# EAGLE design TCXOBreakout (EAGLE 7.2.0)
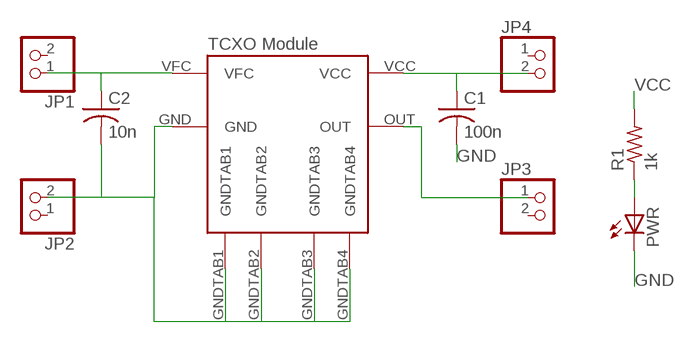
[diagram p0: schematic, sheet 1]

## Parts
C1  100n  C-USC0603  [C0603]
C2  10n  C-USC0603  [C0603]
JP1  PINHD-1X2  [1X02]
JP2  PINHD-1X2  [1X02]
JP3  PINHD-1X2  [1X02]
JP4  PINHD-1X2  [1X02]
PWR  LEDCHIPLED_0805  [CHIPLED_0805]
R1  1k  R-US_R0603  [R0603]
U$1  TCXO2  [TCXO2]

## Nets
GND: C1.2 C2.2 JP2.2 PWR.C U$1.GND U$1.GNDTAB1 U$1.GNDTAB2 U$1.GNDTAB3 U$1.GNDTAB4
N$1: PWR.A R1.1
N$2: C2.1 JP1.1 U$1.VFC
N$4: JP3.1 U$1.OUT
VCC: C1.1 JP4.2 R1.2 U$1.VCC
Unconnected: JP1.2 JP2.1 JP3.2 JP4.1

## Notes on the sheet
- TCXO Module

## Library data of the parts
C1 C2 = adafruit:C-US: CAPACITOR, American symbol
JP1-JP4 = pinhead:PINHD-1X2: PIN HEADER
PWR = adafruit:LED: LED OSRAM: - CHIPLED LG R971, LG N971, LY N971, LG Q971, LY Q971, LO R971, LY R971 LH N974, LH R974 LS Q976, LO Q976, LY Q976 LO Q996 - Hyper CHIPLED LW Q18S LB Q993, LB Q99A, LB R99A - SideLED LS A670, LO A670, LY A670, LG A670, LP A670 LB A673, LV A673, LT A673, LW A673 LH A674 LY A675 LS A676, LA A676, LO A676, LY A676, LW A676 LS A679, LY A679, LG A679 - Hyper Micro SIDELED® LS Y876, LA Y876, LO Y876, LY Y876 LT Y87S - SmartLED LW L88C, LW L88S LB L89C, LB L89S, LG L890 LS L89K, LO L89K, LY L89K LS L896, LA L896, LO L896, LY L896 - TOPLED LS T670, LO T670, LY T670, LG T670, LP T670 LSG T670, LSP T670, LSY T670, LOP T670, LYG T670 LG T671, LOG T671, LSG T671 LB T673, LV T673, LT T673, LW T673 LH T674 LS T676, LA T676, LO T676, LY T676, LB T676, LH T676, LSB T676, LW T676 LB T67C, LV T67C, LT T67C, LS T67K, LO T67K, LY T67K, LW E67C LS E67B, LA E67B, LO E67B, LY E67B, LB E67C, LV E67C, LT E67C LW T67C LS T679, LY T679, LG T679 LS T770, LO T770, LY T770, LG T770, LP T770 LB T773, LV T773, LT T773, LW T773 LH T774 LS E675, LA E675, LY E675, LS T675 LS T776, LA T776, LO T776, LY T776, LB T776 LHGB T686 LT T68C, LB T68C - Hyper Mini TOPLED® LB M676 - Mini TOPLED Santana® LG M470 LS M47K, LO M47K, LY M47K Source: http://www.osram.convergy.de/
R1 = adafruit:R-US_: RESISTOR, American symbol
U$1 = _CustomParts:TCXO2

## Board
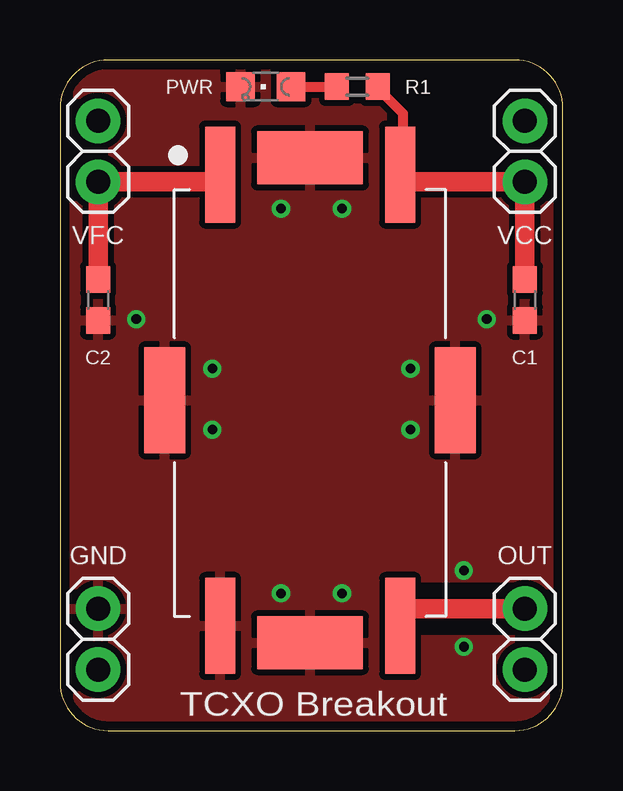
[diagram p1: board, top side]
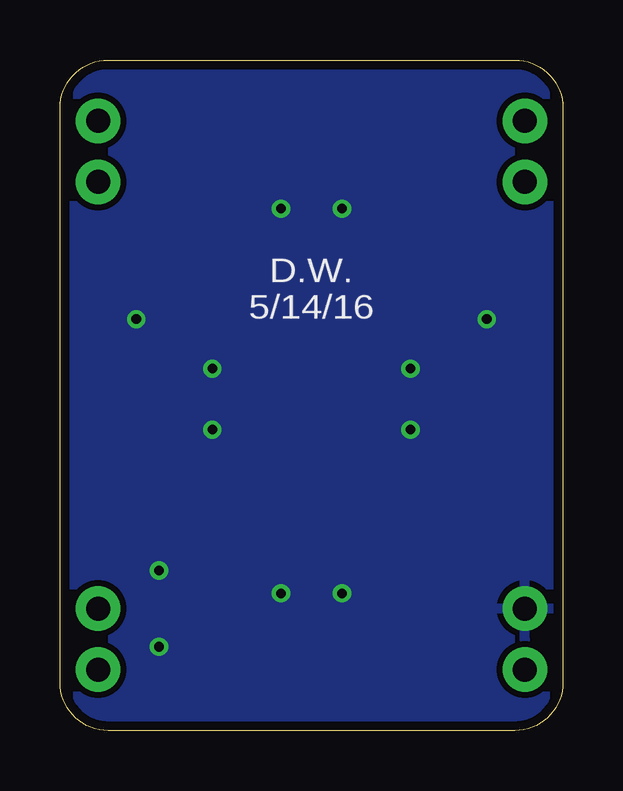
[diagram p2: board, bottom side, seen from below]

Size 20.96 x 27.94 mm. Coordinates in mm from the lower left corner, seen from the top.
Outline: 0,25.94 0,2 arc90 2,0 18.96,0 arc90 20.96,2 20.96,25.94 arc90 18.96,27.94 2,27.94 arc90 0,25.94
Copper layers (1*16): Top 0.0356mm / dielectric 1.5011mm / Bottom 0.0356mm
Design rules "oshpark-2layer *": minimum track width 6mil, minimum drill 13mil, track to track 6mil, track to pad 6mil, pad to pad 6mil, via to via 6mil, smd to smd 6mil, copper to edge 15mil, drill to drill 6mil, minimum pad ring 7mil, minimum via ring 7mil, stop-mask expansion 4mil, vias tented up to drill 20mil, thermal gap 10mil
tRestrict: 1 lines

### Footprints (pad centres in the part's own frame; a part is rotated, then mirrored left to right if it is on the bottom)
C0603 = smd 1.1 x 1: 1 -0.85,0; 2 0.85,0
1X02 = drill 1 pad 1.85: 1 -1.27,0; 2 1.27,0
CHIPLED_0805 = smd 1.2 x 1.2: A 0,-1.05; C 0,1.05
R0603 = smd 1 x 1.1: 1 -0.85,0; 2 0.85,0
TCXO2 = smd 1.25 x 4: GND 0,-0.4; OUT 7.5,-0.4; VCC 7.5,18.4; VFC 0,18.4 | smd 4.4 x 2.2: GNDTAB1 3.75,19.1; GNDTAB3 3.75,-1.1 | smd 1.7 x 4.4: GNDTAB2 -2.3,9; GNDTAB4 9.8,9

### Placement (x,y rotation side)
C1  19.37,17.94 270 top
C2  1.59,17.94 270 top
JP1  1.59,24.13 90 top
JP2  1.59,3.81 90 top
JP3  19.37,3.81 270 top
JP4  19.37,24.13 270 top
PWR  8.57,26.83 90 top
R1  12.38,26.83 0 top
U$1  6.67,4.76 0 top

### Tracks (layer width: path | path; a pad name or v marks a point on that pad's centre or on a via)
GND  (via drill 0.4)
  other vias: 11.75,5.71 6.35,12.54 9.21,21.75 14.6,12.54 9.21,5.71 11.75,21.75 6.35,15.08 14.6,15.08 16.83,6.67 16.83,3.49 3.18,17.14 17.78,17.14
  pour Bottom (isolate 0.254): -2.86,33.02 -2.86,-1.27 23.81,-1.27 23.81,33.02
  pour Top (isolate 0.254): -4.13,34.29 -4.13,-2.54 25.08,-2.54 25.08,34.29
N$1
  Top 0.406: PWR.A R1.1
N$2
  Top 0.813: U$1.VFC 6.67,22.86 JP1.1 C2.1
N$4
  Top 0.813: JP3.1 14.29,5.08 14.29,4.48 U$1.OUT
VCC
  Top 0.406: R1.2 13.23,26.77 14.29,25.72 14.29,23.28 U$1.VCC
  Top 0.813: U$1.VCC 14.17,22.86 JP4.2 C1.1

### Text on the board
tNames: PWR | R1 | VFC | VCC | C2 | C1 | GND | OUT | TCXO Breakout
bNames: D.W. / 5/14/16